# Altium schematic sheet main.SchDoc
size A; SheetNumber: 1; SheetTotal: 1
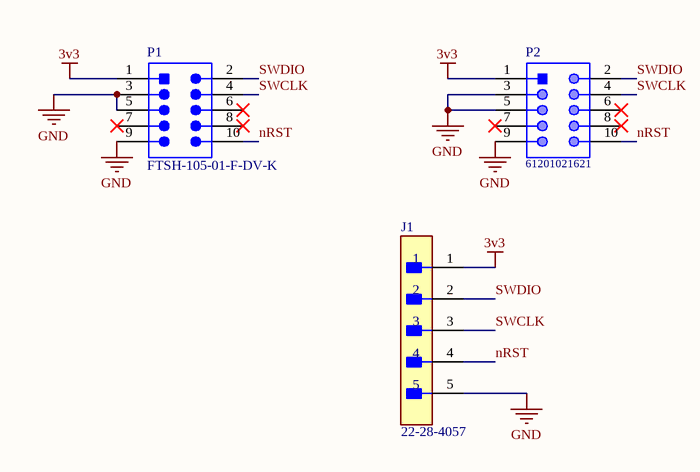
[diagram p0: main.SchDoc]

## Parts
J1  22-28-4057  [FP-22-28-4057-MFG]
P1  FTSH-105-01-F-DV-K  [SMTC-FTSH-105-01-L-DV-K_V]
P2  61201021621  [61201021621]

## Nets
3v3: J1.1 P1.1 P2.1
GND: J1.5 P1.3 P1.5 P1.9 P2.3 P2.5 P2.9
nRST: J1.4 P1.10 P2.10
SWCLK: J1.3 P1.4 P2.4
SWDIO: J1.2 P1.2 P2.2

Not connected (* = marked no-connect by the designer): P1 6* 7* 8*; P2 6* 7* 8*

## Library data of the parts
J1 = CMP-04776-001007-1: KK 100 HDR ASSY BKWY 05 CKT 30 S; Connector Type: Male Pin; Number of Contacts: 5; Glow Wire Compliant: Non-compliant; Gender: Male; Max Voltage Rating (DC): 250.25kV; Pitch: 2.54mm; Current Rating: 4A; Voltage Rating: 250V; Contact Resistance: 20mR; Min Operating Temperature: 0°C; Mount: Through Hole; Lead Free: Lead Free; Housing Color: Black; Max Operating Temperature: 75°C; Color: Black; Number of Rows: 1; Number of Circuits: 5; Contact Material: Brass; Packaging: Bulk; Contact Plating: Gold; Package Quantity: 1; Orientation: Straight; RoHS Compliant: Yes; Contact Type: Male Pin; Termination: Solder; Contact Mating Length: 0.32inch; Series: 42375; Number of Positions: 5; Housing Material: Thermoplastic
P1 = CMP-2000-05352-1: Male Header, Pitch 1.27 mm, 2 x 5 Position, Height 6.12 mm, RoHS, Tube; Manufacturer: Samtec; Number of Positions: 10; Connector Type: Header,Shrouded; Number of Positions Loaded: All; Row Spacing: 0.050"(1.27mm); Fastening Type: -; Package Reference: FTSH-105-01-L-DV-K; Termination: Solder; Package URL: http://suddendocs.samtec.com/prints/ftsh-1xx-xx-xxx-dv-xxx-footprint.pdf; Number of Rows: 2; Contact Finish Thickness: 3µin(0.08µm); Contact Type: MalePin; Manufacturer URL: http://www.samtec.com/; Contact Mating Length: 0.120"(3.05mm); Pitch: 0.050"(1.27mm); Series: FTSH; Features: -; Contact Finish: Gold; Color: Black; Family: RectangularConnectors-Headers,MalePins; Datasheet URL: http://suddendocs.samtec.com/prints/ftsh-1xx-xx-xxx-dv-xxx-mkt.pdf; Package Description: Male Header, Pitch 1.27 mm, 2 x 5 Position, Height 5.97 mm, Tail Length 4.32 mm; Mounting Type: SurfaceMount; Datasheet Version: Rev. ET, 10/1995; Category: Connectors,Interconnects; Packaging: Tube
P2 = CMP-1502-00007-1: Male Box Header WR-BHD, THT, Vertical, pitch 2.54 mm, 10 pins; Manufacturer: Wurth Elektronik; Contact Resistance: 20mOhm; Withstanding Voltage: 500VAC; Pin Number: 10; Working Voltage: 250VAC; Pitch: 2.54mm; Mounting Technology: THT; Operating Temperature: -40to125degC; Published Date: August2018; Gender: Male; Packaging: Tray; Manufacturer URL: http://www.we-online.de; Datasheet URL: https://katalog.we-online.de/em/datasheet/6120xx21621.pdf; Orientation: Vertical; Package Reference: 61201021621; Part Number: 61201021621; Publisher: WurthElektronik